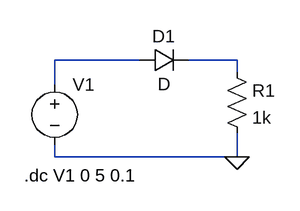
[diagram p0: schematic ForwardBias.asc]
ForwardBias.asc, the LTspice schematic file:
Version 4.1
SHEET 1 880 680
WIRE 208 128 96 128
WIRE 336 128 272 128
WIRE 336 144 336 128
WIRE 96 160 96 128
WIRE 96 256 96 240
WIRE 336 256 336 224
WIRE 336 256 96 256
FLAG 336 256 0
SYMBOL diode 208 144 R270
WINDOW 0 32 32 VTop 2
WINDOW 3 0 32 VBottom 2
SYMATTR InstName D1
SYMBOL res 320 128 R0
SYMATTR InstName R1
SYMATTR Value 1k
SYMBOL voltage 96 144 R0
WINDOW 123 0 0 Left 0
WINDOW 39 0 0 Left 0
SYMATTR InstName V1
SYMATTR Value ""
TEXT 56 280 Left 2 !.dc V1 0 5 0.1

The netlist it stands for:
* ForwardBias.asc
D1 N001 N002 D
R1 N002 0 1k
V1 N001 0
.model D D
.lib standard.dio
.dc V1 0 5 0.1
.backanno
.end